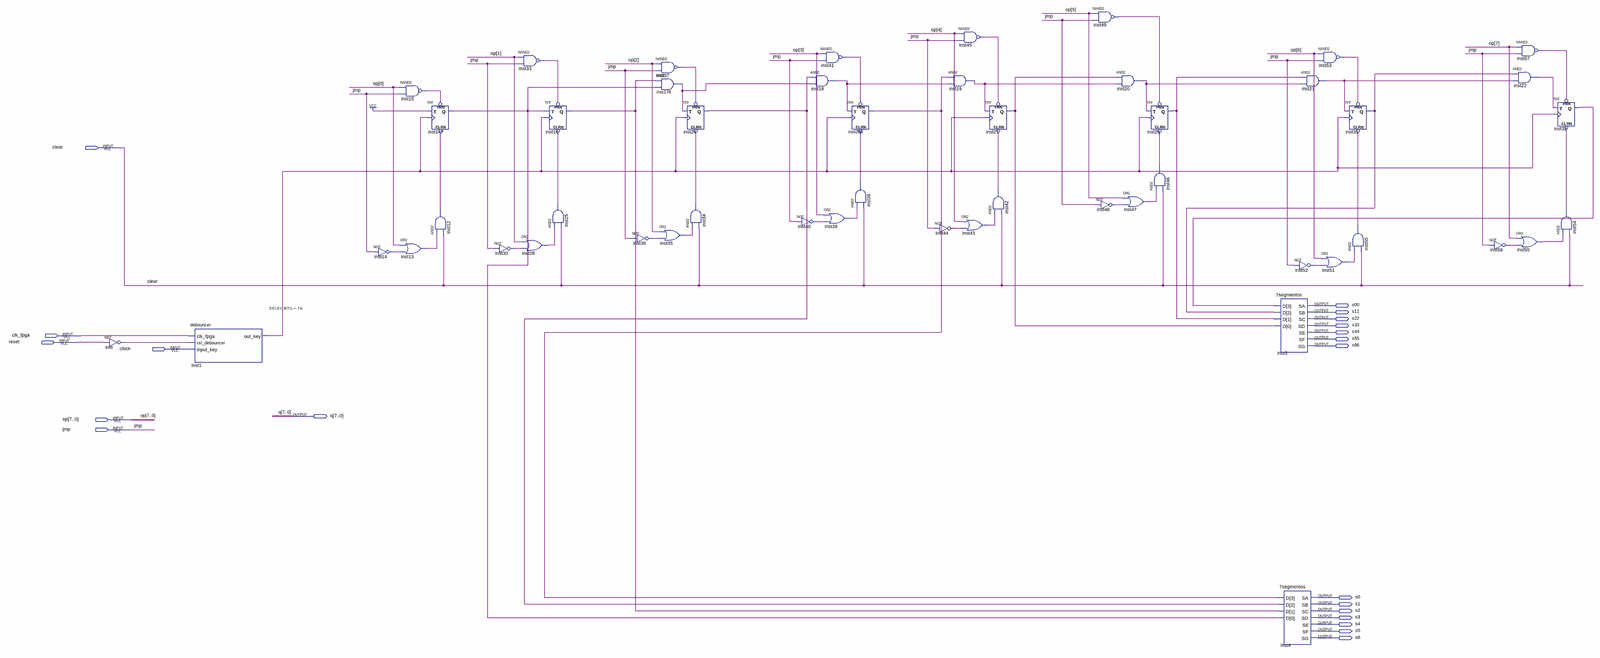
[diagram p0: schematic sheet, whole]
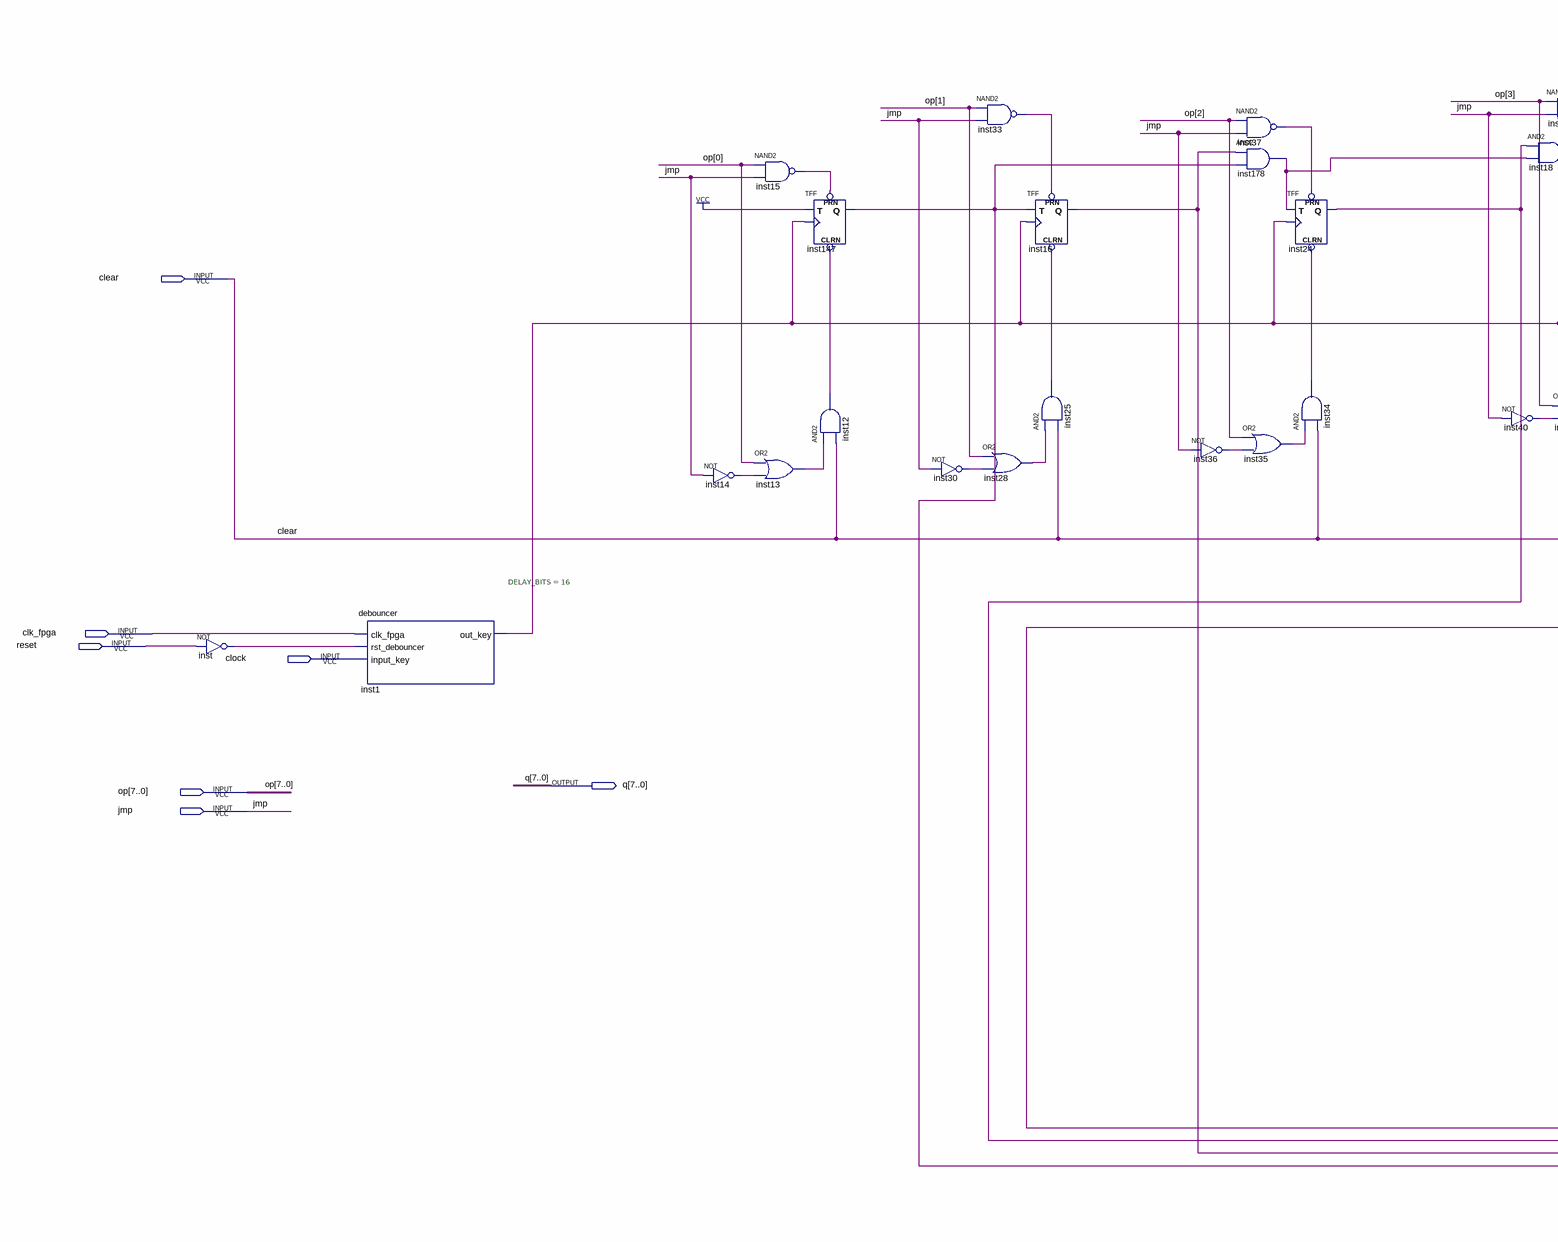
[diagram p1: schematic sheet, left part]
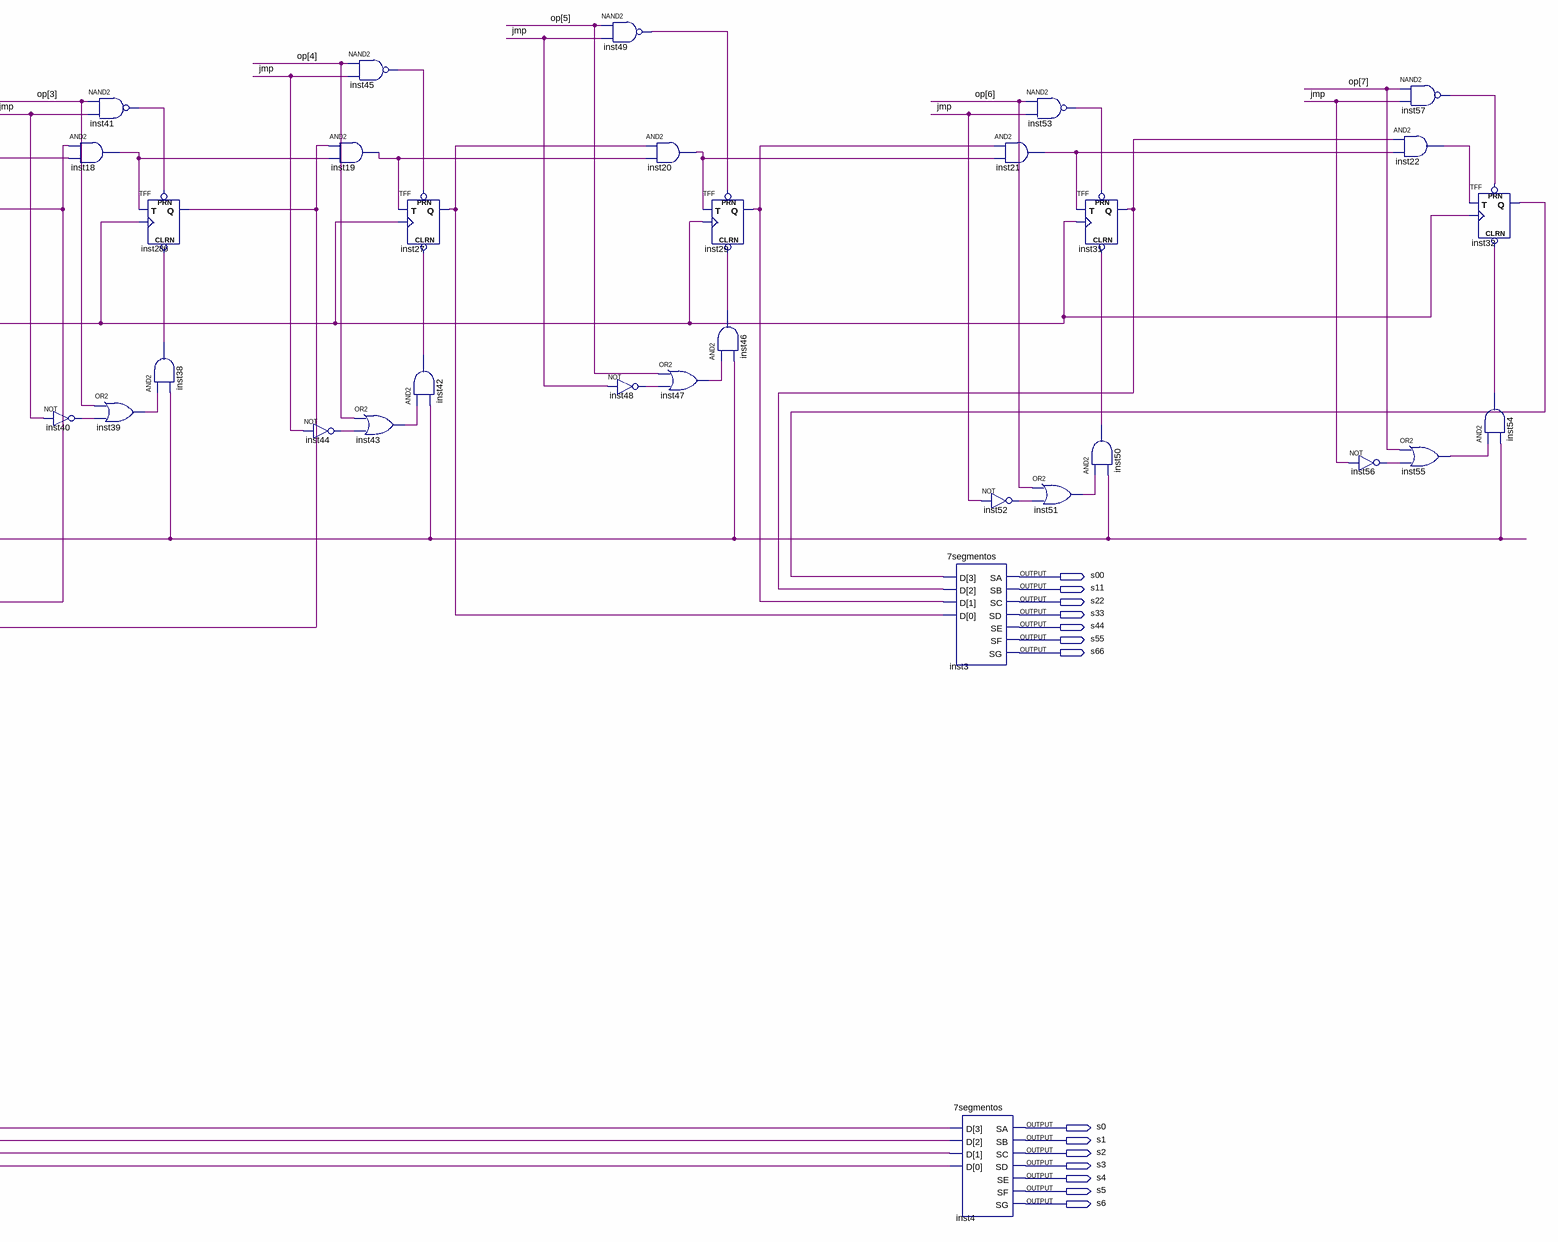
[diagram p2: schematic sheet, right part]
// Quartus schematic contador.bdf as structural Verilog: 50 symbols, 21 pins
module contador (
  input  clear,
  input  clk_fpga,
  input  reset,
  input  clock,
  input  [7:0] op,
  input  jmp,
  output s00,
  output s11,
  output s22,
  output s33,
  output s44,
  output s55,
  output s66,
  output [7:0] q,
  output s0,
  output s1,
  output s2,
  output s3,
  output s4,
  output s5,
  output s6
);

  wire inst1_out_key, inst12_out, inst13_out, inst14_out, inst15_out, inst16_q, inst18_out, inst19_out,
       inst20_out, inst21_out, inst22_out, inst24_q, inst25_out, inst27_q, inst28_out, inst29_q, inst30_out,
       inst31_q, inst32_q, inst33_out, inst34_out, inst35_out, inst36_out, inst37_out, inst38_out,
       inst39_out, inst40_out, inst41_out, inst42_out, inst43_out, inst44_out, inst45_out, inst46_out,
       inst47_out, inst48_out, inst49_out, inst50_out, inst51_out, inst52_out, inst53_out, inst54_out,
       inst55_out, inst56_out, inst57_out, inst147_q, inst178_out, inst286_q, inst_out;

  not inst (inst_out, reset);
  debouncer #(.DELAY_BITS(16)) inst1 (
    .clk_fpga(clk_fpga), .rst_debouncer(inst_out), .input_key(clock), .out_key(inst1_out_key));
  not inst14 (inst14_out, jmp);
  nand inst15 (inst15_out, op[0], jmp);
  or inst13 (inst13_out, op[0], inst14_out);
  TFF inst147 (.PRN(inst15_out), .CLRN(inst12_out), .T(1'b1), .CLK(inst1_out_key), .Q(inst147_q));
  and inst12 (inst12_out, inst13_out, clear);
  not inst30 (inst30_out, jmp);
  nand inst33 (inst33_out, op[1], jmp);
  or inst28 (inst28_out, op[1], inst30_out);
  TFF inst16 (.PRN(inst33_out), .CLRN(inst25_out), .T(inst147_q), .CLK(inst1_out_key), .Q(inst16_q));
  and inst25 (inst25_out, inst28_out, clear);
  not inst36 (inst36_out, jmp);
  nand inst37 (inst37_out, op[2], jmp);
  and inst178 (inst178_out, inst16_q, inst147_q);
  or inst35 (inst35_out, op[2], inst36_out);
  TFF inst24 (.PRN(inst37_out), .CLRN(inst34_out), .T(inst178_out), .CLK(inst1_out_key), .Q(inst24_q));
  and inst34 (inst34_out, inst35_out, clear);
  not inst40 (inst40_out, jmp);
  nand inst41 (inst41_out, op[3], jmp);
  and inst18 (inst18_out, inst24_q, inst178_out);
  or inst39 (inst39_out, op[3], inst40_out);
  TFF inst286 (.PRN(inst41_out), .CLRN(inst38_out), .T(inst18_out), .CLK(inst1_out_key), .Q(inst286_q));
  and inst38 (inst38_out, inst39_out, clear);
  not inst44 (inst44_out, jmp);
  nand inst45 (inst45_out, op[4], jmp);
  and inst19 (inst19_out, inst286_q, inst18_out);
  or inst43 (inst43_out, op[4], inst44_out);
  TFF inst27 (.PRN(inst45_out), .CLRN(inst42_out), .T(inst19_out), .CLK(inst1_out_key), .Q(inst27_q));
  and inst42 (inst42_out, inst43_out, clear);
  nand inst49 (inst49_out, op[5], jmp);
  not inst48 (inst48_out, jmp);
  and inst20 (inst20_out, inst27_q, inst19_out);
  or inst47 (inst47_out, op[5], inst48_out);
  TFF inst29 (.PRN(inst49_out), .CLRN(inst46_out), .T(inst20_out), .CLK(inst1_out_key), .Q(inst29_q));
  and inst46 (inst46_out, inst47_out, clear);
  \7segmentos  inst3 (
    .D({inst32_q, inst31_q, inst29_q, inst27_q}), .SA(s00), .SB(s11), .SC(s22), .SD(s33), .SE(s44), .SF(s55),
    .SG(s66));
  \7segmentos  inst4 (
    .D({inst286_q, inst24_q, inst16_q, inst147_q}), .SA(s0), .SB(s1), .SC(s2), .SD(s3), .SE(s4), .SF(s5),
    .SG(s6));
  and inst21 (inst21_out, inst29_q, inst20_out);
  not inst52 (inst52_out, jmp);
  nand inst53 (inst53_out, op[6], jmp);
  or inst51 (inst51_out, op[6], inst52_out);
  TFF inst31 (.PRN(inst53_out), .CLRN(inst50_out), .T(inst21_out), .CLK(inst1_out_key), .Q(inst31_q));
  and inst50 (inst50_out, inst51_out, clear);
  not inst56 (inst56_out, jmp);
  nand inst57 (inst57_out, op[7], jmp);
  and inst22 (inst22_out, inst31_q, inst21_out);
  or inst55 (inst55_out, op[7], inst56_out);
  TFF inst32 (.PRN(inst57_out), .CLRN(inst54_out), .T(inst22_out), .CLK(inst1_out_key), .Q(inst32_q));
  and inst54 (inst54_out, inst55_out, clear);
endmodule
